# EAGLE schematic PPU_MINI (EAGLE 9.4.2)
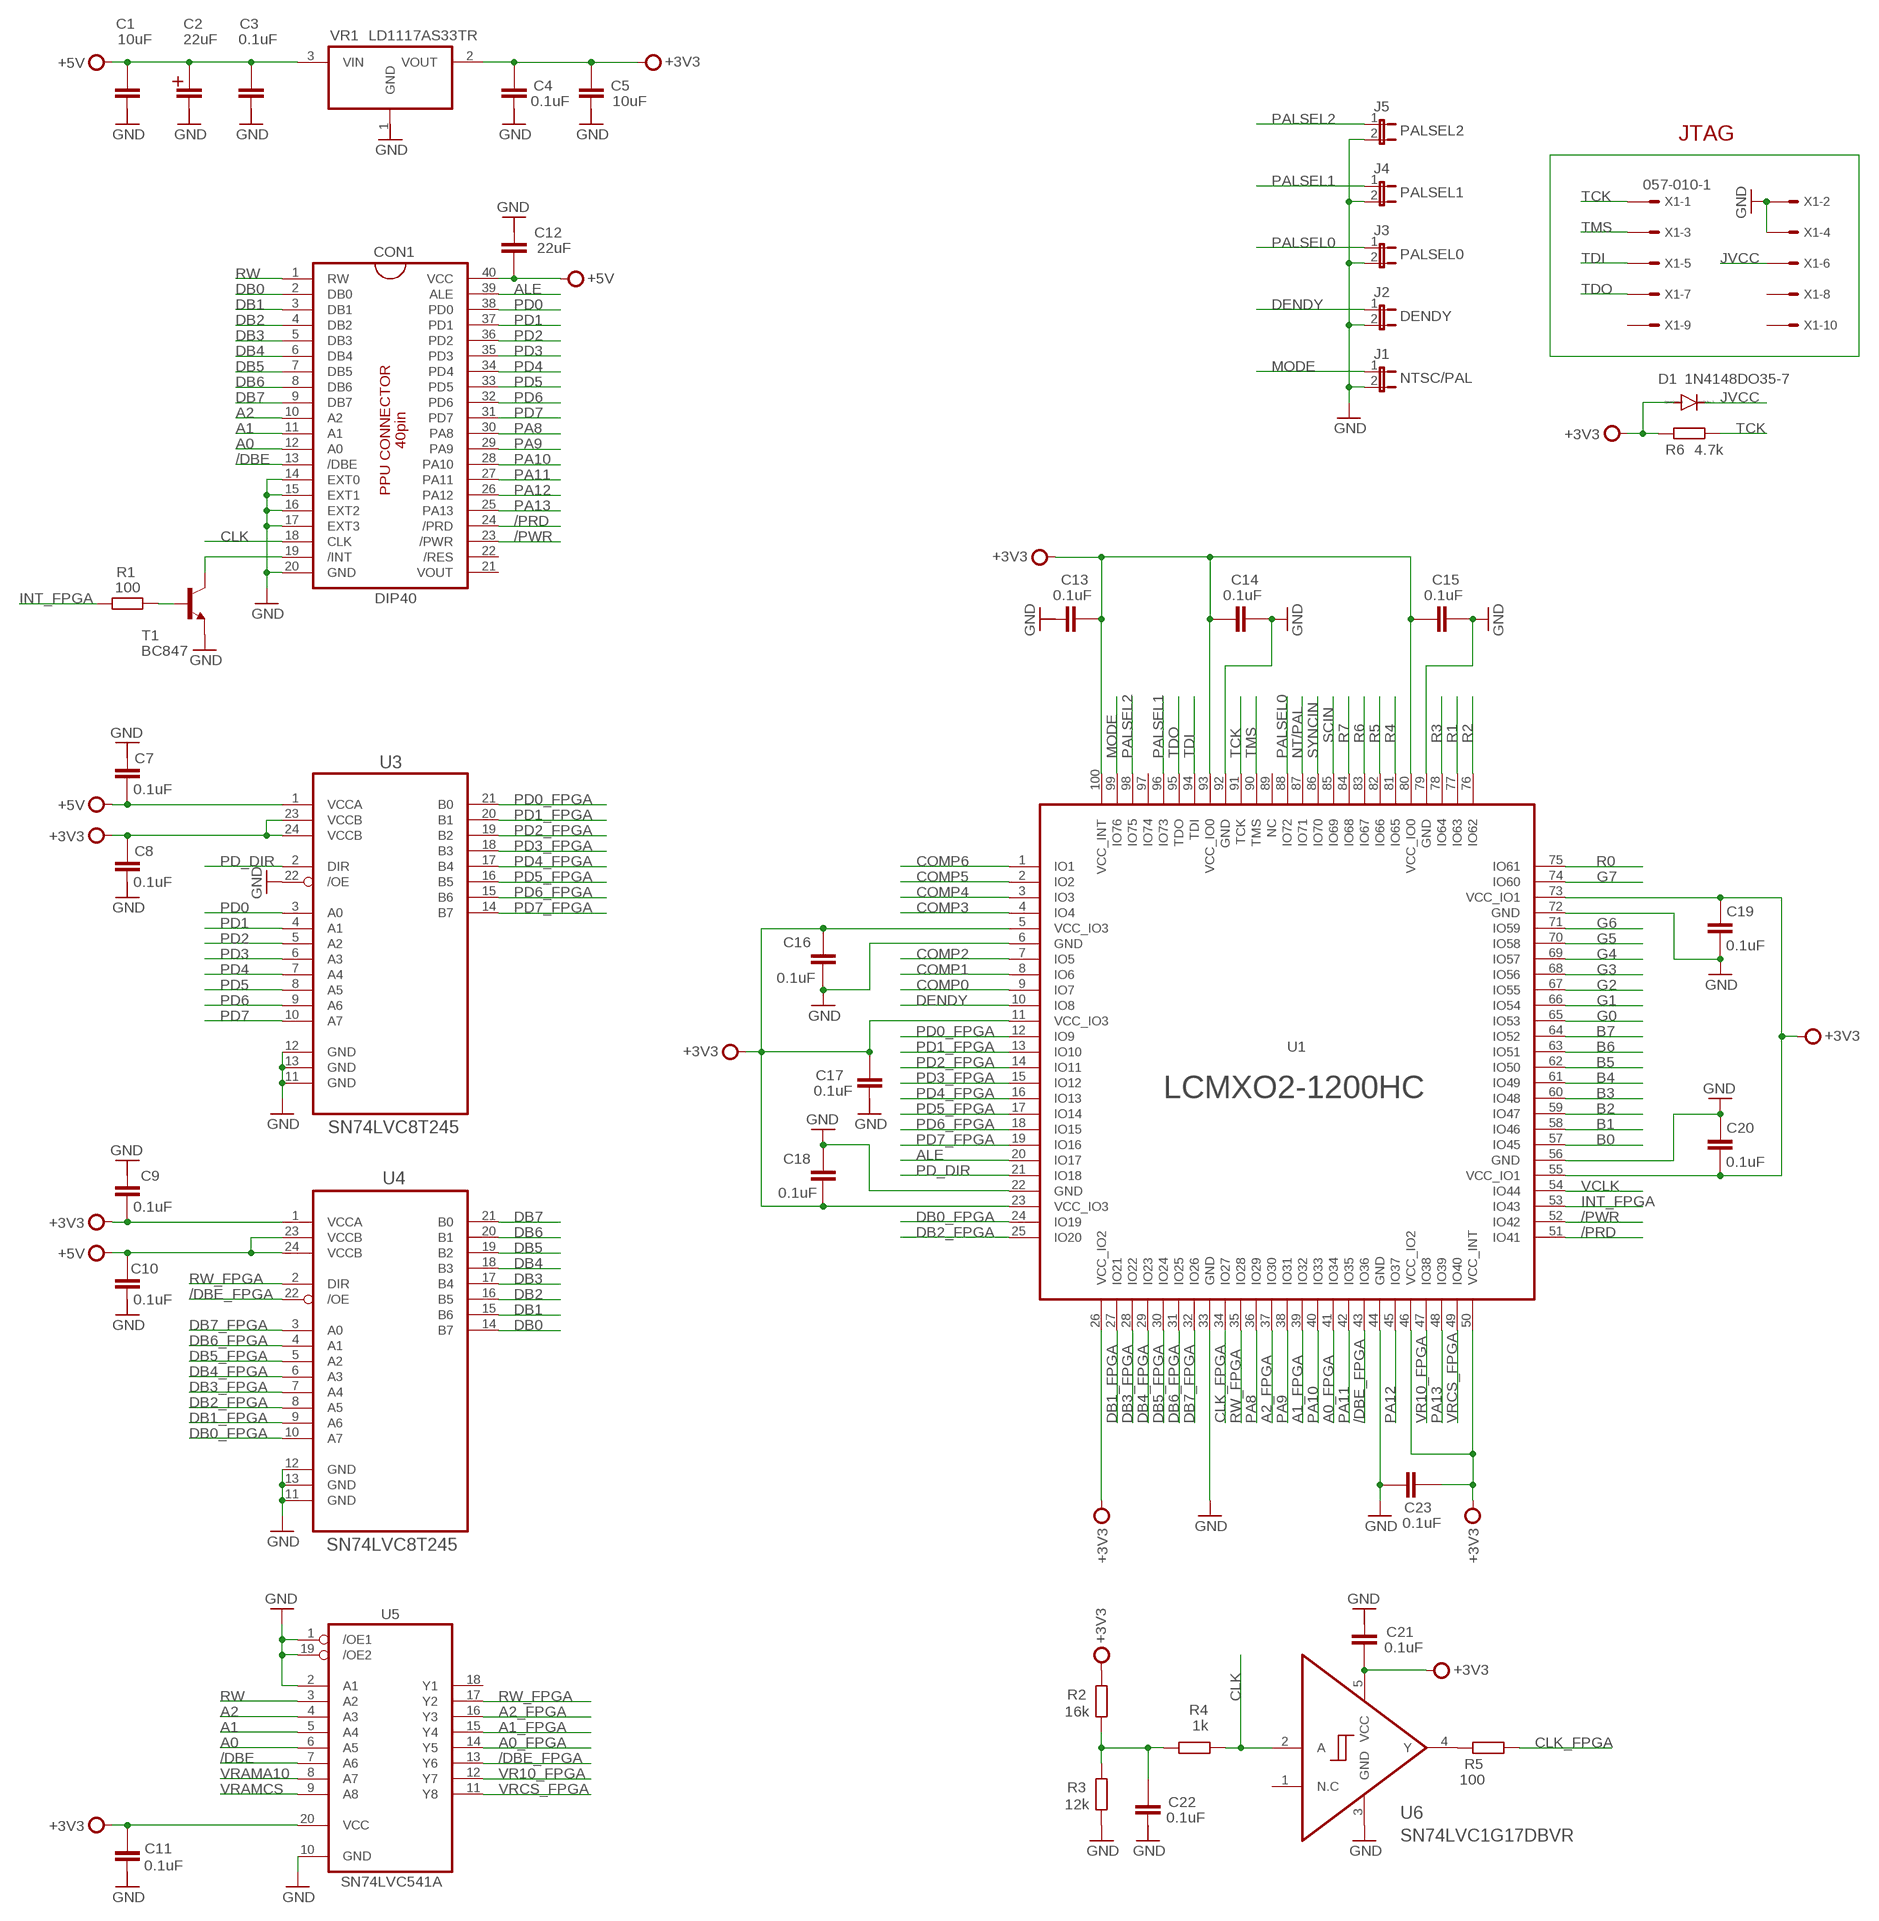
[diagram p0: schematic, sheet 1, part 1 of 2]
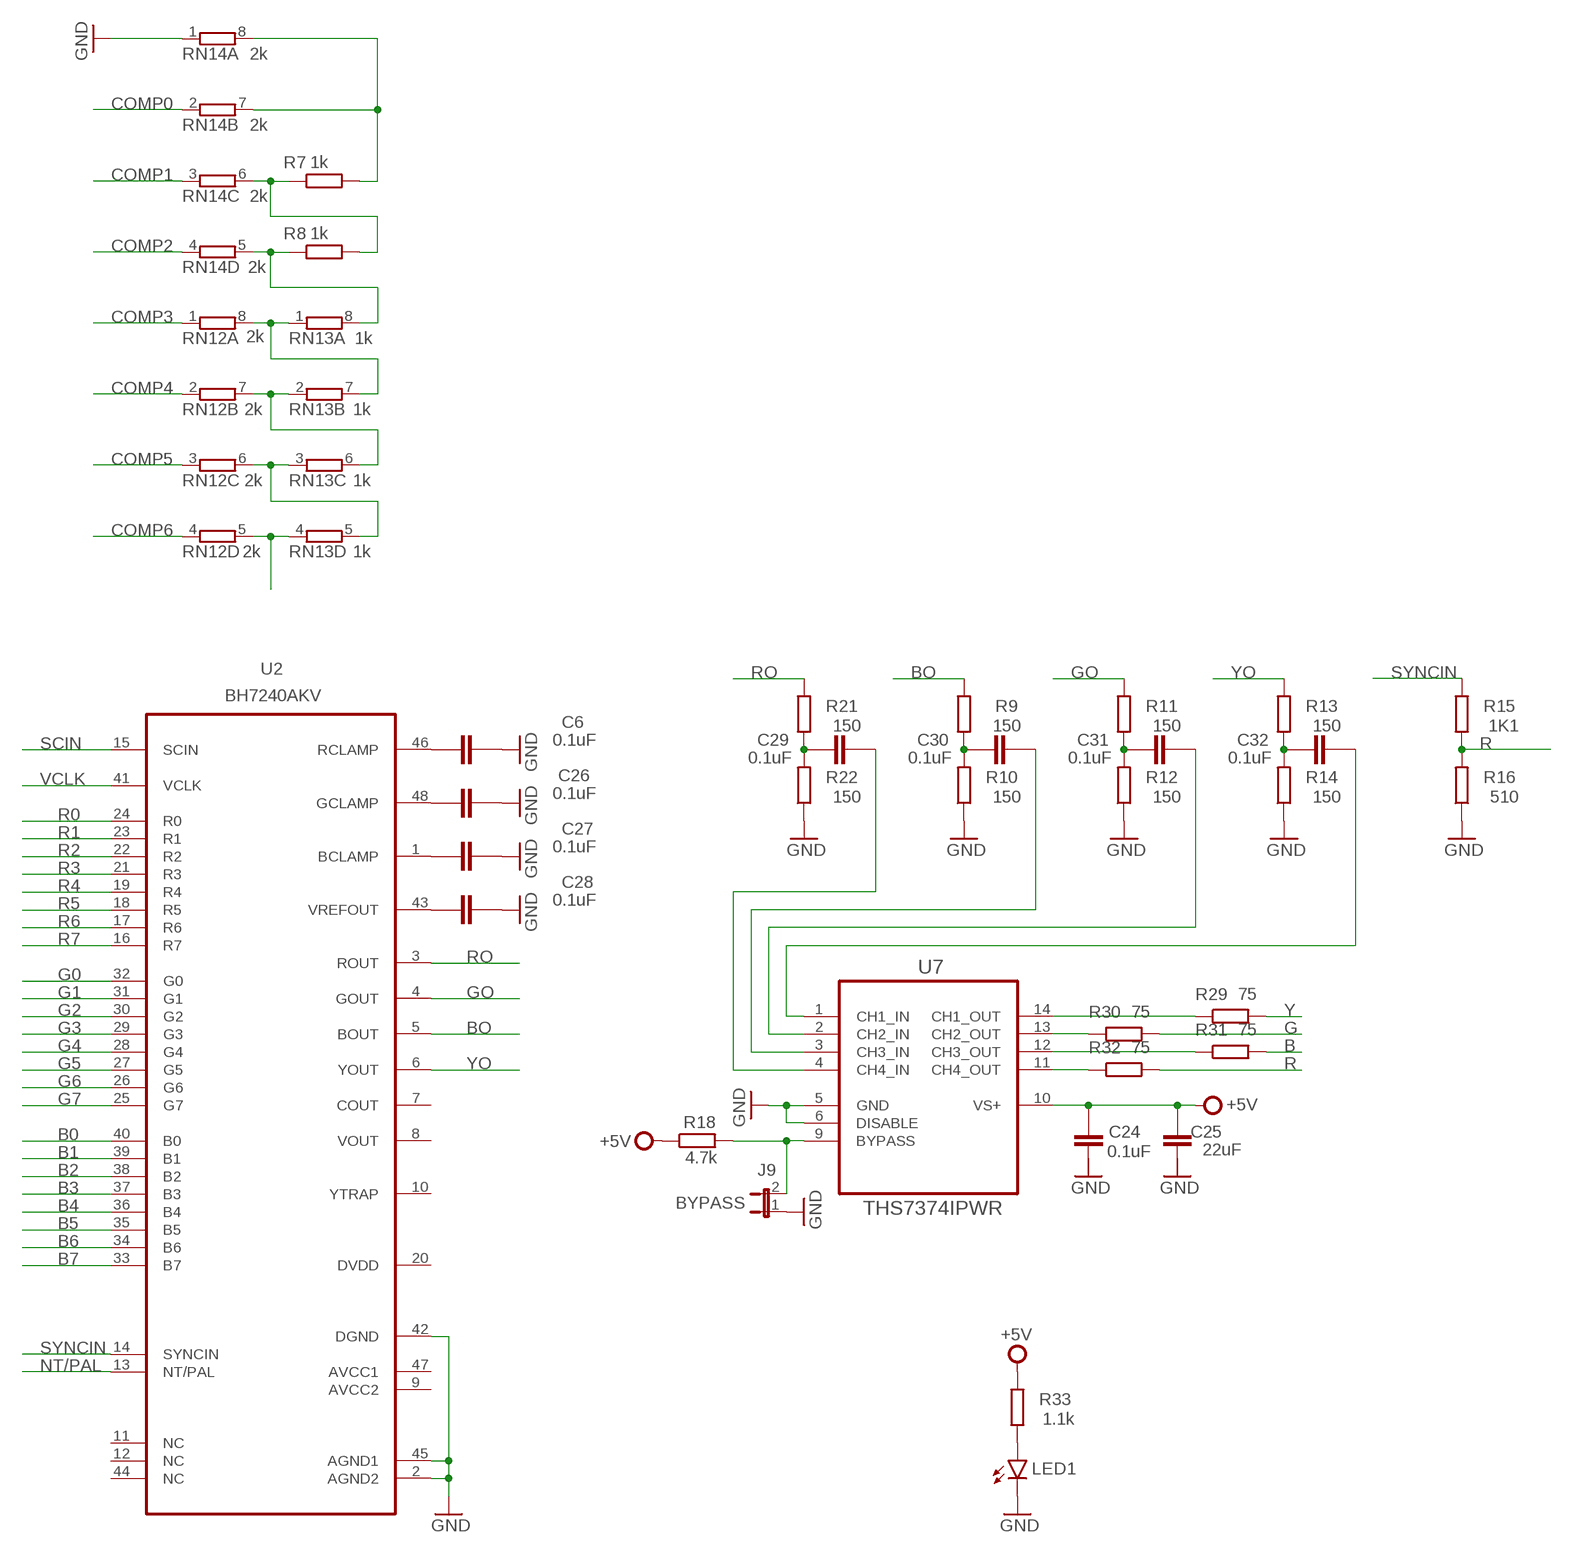
[diagram p1: schematic, sheet 1, part 2 of 2]

## Parts
C1  10uF  C-EUC0603  [C0603]
C2  22uF  CPOL-EU150CLZ-1014  [150CLZ-1014]
C3  0.1uF  C-EUC0603  [C0603]
C4  0.1uF  C-EUC0603  [C0603]
C5  10uF  C-EUC0603  [C0603]
C6  0.1uF  C-EUC0603  [C0603]
C7  0.1uF  C-EUC0603  [C0603]
C8  0.1uF  C-EUC0603  [C0603]
C9  0.1uF  C-EUC0603  [C0603]
C10  0.1uF  C-EUC0603  [C0603]
C11  0.1uF  C-EUC0603  [C0603]
C12  22uF  C-EUC0603  [C0603]
C13  0.1uF  C-EUC0603  [C0603]
C14  0.1uF  C-EUC0603  [C0603]
C15  0.1uF  C-EUC0603  [C0603]
C16  0.1uF  C-EUC0603  [C0603]
C17  0.1uF  C-EUC0603  [C0603]
C18  0.1uF  C-EUC0603  [C0603]
C19  0.1uF  C-EUC0603  [C0603]
C20  0.1uF  C-EUC0603  [C0603]
C21  0.1uF  C-EUC0603  [C0603]
C22  0.1uF  C-EUC0603  [C0603]
C23  0.1uF  C-EUC0603  [C0603]
C24  0.1uF  C-EUC0603  [C0603]
C25  22uF  C-EUC0603  [C0603]
C26  0.1uF  C-EUC0603  [C0603]
C27  0.1uF  C-EUC0603  [C0603]
C28  0.1uF  C-EUC0603  [C0603]
C29  0.1uF  C-EUC0603  [C0603]
C30  0.1uF  C-EUC0603  [C0603]
C31  0.1uF  C-EUC0603  [C0603]
C32  0.1uF  C-EUC0603  [C0603]
CON1  DIP40  [DIP-40]
D1  1N4148DO35-7  [DO35-7]
J1  NTSC/PAL  JP1E  [JP1]
J2  DENDY  JP1E  [JP1]
J3  PALSEL0  JP1E  [JP1]
J4  PALSEL1  JP1E  [JP1]
J5  PALSEL2  JP1E  [JP1]
J9  BYPASS  JP1E  [JP1]
LED1  LEDSML1206  [SML1206]
R1  100  R-EU_R0805  [R0805]
R2  16k  R-EU_R0805  [R0805]
R3  12k  R-EU_R0805  [R0805]
R4  1k  R-EU_R0805  [R0805]
R5  100  R-EU_R0805  [R0805]
R6  4.7k  R-EU_R0805  [R0805]
R7  1k  R-EU_R0805  [R0805]
R8  1k  R-EU_R0805  [R0805]
R9  150  R-EU_R0805  [R0805]
R10  150  R-EU_R0805  [R0805]
R11  150  R-EU_R0805  [R0805]
R12  150  R-EU_R0805  [R0805]
R13  150  R-EU_R0805  [R0805]
R14  150  R-EU_R0805  [R0805]
R15  1K1  R-EU_R0805  [R0805]
R16  510  R-EU_R0805  [R0805]
R18  4.7k  R-EU_R0805  [R0805]
R21  150  R-EU_R0805  [R0805]
R22  150  R-EU_R0805  [R0805]
R29  75  R-EU_R0805  [R0805]
R30  75  R-EU_R0805  [R0805]
R31  75  R-EU_R0805  [R0805]
R32  75  R-EU_R0805  [R0805]
R33  1.1k  R-EU_R0805  [R0805]
RN12  2k  4R-N0603-ARC  [0603-ARC]
RN13  1k  4R-N0603-ARC  [0603-ARC]
RN14  2k  4R-N0603-ARC  [0603-ARC]
T1  BC847  [SOT23]
U1  LCMXO2-1200HC  [QFP50P1600X1600X120-100N]
U2  BH7240AKV  [QFP50P900X900X160-48N]
U3  SN74LVC8T245  [SOP65P640X110-24N]
U4  SN74LVC8T245  [SOP65P640X110-24N]
U5  SN74LVC541A  [TSOP20]
U6  SN74LVC1G17DBVR  [SOT95P280X145-5N]
U7  THS7374IPWR  [SOP65P640X120-14N]
VR1  LD1117AS33TR  [SOT230P700X180-4N]
X1  057-010-1  [057-010-1]

## Nets
+3V3: C4.2 C5.2 C8.2 C9.1 C11.2 C13.1 C14.2 C15.2 C16.2 C17.2 C18.1 C19.2 C20.1 C21.1 D1.A R2.2 R6.2 U1.5(VCC_IO3) U1.11(VCC_IO3) U1.23(VCC_IO3) U1.26(VCC_IO2) U1.55(VCC_IO1) U1.73(VCC_IO1) U1.80(VCC_IO0) U1.93(VCC_IO0) U1.100(VCC_INT) U3.23(VCCB) U3.24(VCCB) U4.1(VCCA) U5.20(VCC) U6.5(VCC) VR1.2(VOUT)
+5V: C1.2 C2.+ C3.2 C7.1 C10.2 C12.1 C24.2 C25.2 CON1.40(VCC) R18.1 R33.2 U3.1(VCCA) U4.23(VCCB) U4.24(VCCB) U7.10(VS+) VR1.3(VIN)
/DBE: CON1.13(/DBE) U5.7(A6)
/DBE_FPGA: U1.43(IO36) U4.22(/OE) U5.13(Y6)
/PRD: CON1.24(/PRD) U1.51(IO41)
/PWR: CON1.23(/PWR) U1.52(IO42)
A0: CON1.12(A0) U5.6(A5)
A0_FPGA: U1.41(IO34) U5.14(Y5)
A1: CON1.11(A1) U5.5(A4)
A1_FPGA: U1.39(IO32) U5.15(Y4)
A2: CON1.10(A2) U5.4(A3)
A2_FPGA: U1.37(IO30) U5.16(Y3)
ALE: CON1.39(ALE) U1.20(IO17)
B: R31.2
B0: U1.57(IO45) U2.40(B0)
B1: U1.58(IO46) U2.39(B1)
B2: U1.59(IO47) U2.38(B2)
B3: U1.60(IO48) U2.37(B3)
B4: U1.61(IO49) U2.36(B4)
B5: U1.62(IO50) U2.35(B5)
B6: U1.63(IO51) U2.34(B6)
B7: U1.64(IO52) U2.33(B7)
BO: R9.2 U2.5(BOUT)
CLK: CON1.18(CLK) R4.1 U6.2(A)
CLK_FPGA: R5.1 U1.34(IO27)
COMP0: RN14.2 U1.9(IO7)
COMP1: RN14.3 U1.8(IO6)
COMP2: RN14.4 U1.7(IO5)
COMP3: RN12.1 U1.4(IO4)
COMP4: RN12.2 U1.3(IO3)
COMP5: RN12.3 U1.2(IO2)
COMP6: RN12.4 U1.1(IO1)
DB0: CON1.2(DB0) U4.14(B7)
DB0_FPGA: U1.24(IO19) U4.10(A7)
DB1: CON1.3(DB1) U4.15(B6)
DB1_FPGA: U1.27(IO21) U4.9(A6)
DB2: CON1.4(DB2) U4.16(B5)
DB2_FPGA: U1.25(IO20) U4.8(A5)
DB3: CON1.5(DB3) U4.17(B4)
DB3_FPGA: U1.28(IO22) U4.7(A4)
DB4: CON1.6(DB4) U4.18(B3)
DB4_FPGA: U1.29(IO23) U4.6(A3)
DB5: CON1.7(DB5) U4.19(B2)
DB5_FPGA: U1.30(IO24) U4.5(A2)
DB6: CON1.8(DB6) U4.20(B1)
DB6_FPGA: U1.31(IO25) U4.4(A1)
DB7: CON1.9(DB7) U4.21(B0)
DB7_FPGA: U1.32(IO26) U4.3(A0)
DENDY: J2.1 U1.10(IO8)
G: R30.2
G0: U1.65(IO53) U2.32(G0)
G1: U1.66(IO54) U2.31(G1)
G2: U1.67(IO55) U2.30(G2)
G3: U1.68(IO56) U2.29(G3)
G4: U1.69(IO57) U2.28(G4)
G5: U1.70(IO58) U2.27(G5)
G6: U1.71(IO59) U2.26(G6)
G7: U1.74(IO60) U2.25(G7)
GND: C6.1 C14.1 C15.1 C16.1 C18.2 C19.1 C20.2 C23.2 C26.1 C27.1 C28.1 CON1.14(EXT0) CON1.15(EXT1) CON1.16(EXT2) CON1.17(EXT3) CON1.20(GND) J1.2 J2.2 J3.2 J4.2 J5.2 J9.1 LED1.C R3.1 R10.1 R12.1 R14.1 R16.1 R22.1 RN14.1 T1.2(E) U1.6(GND) U1.22(GND) U1.33(GND) U1.44(GND) U1.56(GND) U1.72(GND) U1.79(GND) U1.92(GND) U2.2(AGND2) U2.42(DGND) U2.45(AGND1) U3.11(GND) U3.12(GND) U3.13(GND) U3.22(/OE) U4.11(GND) U4.12(GND) U4.13(GND) U5.1(/OE1) U5.2(A1) U5.10(GND) U5.19(/OE2) U6.3(GND) U7.5(GND) U7.6(DISABLE) X1.2 X1.4
GO: R11.2 U2.4(GOUT)
INT_FPGA: R1.1 U1.53(IO43)
JVCC: D1.C X1.6
MODE: J1.1 U1.99(IO76)
N$1: LED1.A R33.1
N$2: R5.2 U6.4(Y)
N$4: CON1.19(/INT) T1.3(C)
N$5: R1.2 T1.1(B)
N$6: RN12.8 RN13.1 RN13.7
N$7: R8.1 RN13.8 RN14.5
N$8: RN12.7 RN13.2 RN13.6
N$9: RN12.6 RN13.3 RN13.5
N$10: C6.2 U2.46(RCLAMP)
N$11: C26.2 U2.48(GCLAMP)
N$12: C27.2 U2.1(BCLAMP)
N$13: C28.2 U2.43(VREFOUT)
N$14: C30.2 R9.1 R10.2
N$15: J9.2 R18.2 U7.9(BYPASS)
N$16: C31.2 R11.1 R12.2
N$17: C29.1 U7.4(CH4_IN)
N$18: C30.1 U7.3(CH3_IN)
N$19: C31.1 U7.2(CH2_IN)
N$20: C32.2 R13.1 R14.2
N$21: C32.1 U7.1(CH1_IN)
N$24: R15.1 R16.2
N$26: R7.2 RN14.7 RN14.8
N$28: R7.1 R8.2 RN14.6
N$34: RN12.5 RN13.4
N$39: C23.1 U1.46(VCC_IO2) U1.50(VCC_INT) ; supply symbol labelled +3V3
N$40: C22.2 R2.1 R3.2 R4.2
N$42: C29.2 R21.1 R22.2
N$64: R29.1 U7.14(CH1_OUT)
N$65: R30.1 U7.13(CH2_OUT)
N$66: R31.1 U7.12(CH3_OUT)
N$67: R32.1 U7.11(CH4_OUT)
NT/PAL: U1.87(IO71) U2.13(NT/PAL)
PA8: CON1.30(PA8) U1.36(IO29)
PA9: CON1.29(PA9) U1.38(IO31)
PA10: CON1.28(PA10) U1.40(IO33)
PA11: CON1.27(PA11) U1.42(IO35)
PA12: CON1.26(PA12) U1.45(IO37)
PA13: CON1.25(PA13) U1.48(IO39)
PALSEL0: J3.1 U1.88(IO72)
PALSEL1: J4.1 U1.96(IO73)
PALSEL2: J5.1 U1.98(IO75)
PD0: CON1.38(PD0) U3.3(A0)
PD0_FPGA: U1.12(IO9) U3.21(B0)
PD1: CON1.37(PD1) U3.4(A1)
PD1_FPGA: U1.13(IO10) U3.20(B1)
PD2: CON1.36(PD2) U3.5(A2)
PD2_FPGA: U1.14(IO11) U3.19(B2)
PD3: CON1.35(PD3) U3.6(A3)
PD3_FPGA: U1.15(IO12) U3.18(B3)
PD4: CON1.34(PD4) U3.7(A4)
PD4_FPGA: U1.16(IO13) U3.17(B4)
PD5: CON1.33(PD5) U3.8(A5)
PD5_FPGA: U1.17(IO14) U3.16(B5)
PD6: CON1.32(PD6) U3.9(A6)
PD6_FPGA: U1.18(IO15) U3.15(B6)
PD7: CON1.31(PD7) U3.10(A7)
PD7_FPGA: U1.19(IO16) U3.14(B7)
PD_DIR: U1.21(IO18) U3.2(DIR)
R: R32.2
R0: U1.75(IO61) U2.24(R0)
R1: U1.77(IO63) U2.23(R1)
R2: U1.76(IO62) U2.22(R2)
R3: U1.78(IO64) U2.21(R3)
R4: U1.81(IO65) U2.19(R4)
R5: U1.82(IO66) U2.18(R5)
R6: U1.83(IO67) U2.17(R6)
R7: U1.84(IO68) U2.16(R7)
RO: R21.2 U2.3(ROUT)
RW: CON1.1(RW) U5.3(A2)
RW_FPGA: U1.35(IO28) U4.2(DIR) U5.17(Y2)
SCIN: U1.85(IO69) U2.15(SCIN)
SYNCIN: R15.2 U1.86(IO70) U2.14(SYNCIN)
TCK: R6.1 U1.91(TCK) X1.1
TDI: U1.94(TDI) X1.5
TDO: U1.95(TDO) X1.7
TMS: U1.90(TMS) X1.3
VCLK: U1.54(IO44) U2.41(VCLK)
VR10_FPGA: U1.47(IO38) U5.12(Y7)
VRAMA10: U5.8(A7)
VRAMCS: U5.9(A8)
VRCS_FPGA: U1.49(IO40) U5.11(Y8)
Y: R29.2
YO: R13.2 U2.6(YOUT)
Unconnected: C1.1 C2.- C3.1 C4.1 C5.1 C7.2 C8.1 C9.2 C10.1 C11.1 C12.2 C13.2 C17.1 C21.2 C22.1 C24.1 C25.1 CON1.21(VOUT) CON1.22(/RES) U1.89(NC) U1.97(IO74) U2.7(COUT) U2.8(VOUT) U2.9(AVCC2) U2.10(YTRAP) U2.11(NC) U2.12(NC) U2.20(DVDD) U2.44(NC) U2.47(AVCC1) U5.18(Y1) U6.1(N.C) VR1.1(GND) X1.8 X1.9 X1.10

## Notes on the sheet
- JTAG

## Library data of the parts
C1 C3-C32 = rcl_my:C-EU: CAPACITOR, European symbol; SPICEPREFIX: C
C2 = rcl_my:CPOL-EU: POLARIZED CAPACITOR, European symbol; SPICEPREFIX: C
CON1 = SnapEDA-Library:DIP40
D1 = diode:1N4148: DIODE high speed (Philips)
J1-J5 J9 = jumper:JP1E: JUMPER
LED1 = led:LED: LED OSRAM: - CHIPLED LG R971, LG N971, LY N971, LG Q971, LY Q971, LO R971, LY R971 LH N974, LH R974 LS Q976, LO Q976, LY Q976 LO Q996 - Hyper CHIPLED LW Q18S LB Q993, LB Q99A, LB R99A - SideLED LS A670, LO A670, LY A670, LG A670, LP A670 LB A673, LV A673, LT A673, LW A673 LH A674 LY A675 LS A676, LA A676, LO A676, LY A676, LW A676 LS A679, LY A679, LG A679 - Hyper Micro SIDELED® LS Y876, LA Y876, LO Y876, LY Y876 LT Y87S - SmartLED LW L88C, LW L88S LB L89C, LB L89S, LG L890 LS L89K, LO L89K, LY L89K LS L896, LA L896, LO L896, LY L896 - TOPLED LS T670, LO T670, LY T670, LG T670, LP T670 LSG T670, LSP T670, LSY T670, LOP T670, LYG T670 LG T671, LOG T671, LSG T671 LB T673, LV T673, LT T673, LW T673 LH T674 LS T676, LA T676, LO T676, LY T676, LB T676, LH T676, LSB T676, LW T676 LB T67C, LV T67C, LT T67C, LS T67K, LO T67K, LY T67K, LW E67C LS E67B, LA E67B, LO E67B, LY E67B, LB E67C, LV E67C, LT E67C LW T67C LS T679, LY T679, LG T679 LS T770, LO T770, LY T770, LG T770, LP T770 LB T773, LV T773, LT T773, LW T773 LH T774 LS E675, LA E675, LY E675, LS T675 LS T776, LA T776, LO T776, LY T776, LB T776 LHGB T686 LT T68C, LB T68C - Hyper Mini TOPLED® LB M676 - Mini TOPLED Santana® LG M470 LS M47K, LO M47K, LY M47K Source: http://www.osram.convergy.de LUXEON: - LUMILED® LXK2-PW12-R00, LXK2-PW12-S00, LXK2-PW14-U00, LXK2-PW14-V00 LXK2-PM12-R00, LXK2-PM12-S00, LXK2-PM14-U00 LXK2-PE12-Q00, LXK2-PE12-R00, LXK2-PE12-S00, LXK2-PE14-T00, LXK2-PE14-U00 LXK2-PB12-K00, LXK2-PB12-L00, LXK2-PB12-M00, LXK2-PB14-N00, LXK2-PB14-P00, LXK2-PB14-Q00 LXK2-PR12-L00, LXK2-PR12-M00, LXK2-PR14-Q00, LXK2-PR14-R00 LXK2-PD12-Q00, LXK2-PD12-R00, LXK2-PD12-S00 LXK2-PH12-R00, LXK2-PH12-S00 LXK2-PL12-P00, LXK2-PL12-Q00, LXK2-PL12-R00 Source: www.luxeon.com KINGBRIGHT: KA-3528ASYC Source: www.kingbright.com
R1-R16 R18 R21 R22 R29-R33 = rcl:R-EU_: RESISTOR, European symbol; SPICEPREFIX: R
RN12-RN14 = resistor-dil:4R-N: Array Chip Resistor Source: RS Component / Phycomp; OC_FARNELL: unknown; OC_NEWARK: unknown
T1 = transistor:BC847: NPN TRANSISTOR
U1 = LCMXO2-1200HC:LCMXO2-1200HC
U2 = BH7240AKV:BH7240AKV
U3 U4 = SnapEDA-Library:SN74LVC8T245
U5 = SnapEDA-Library:SN74LVC541A; PACKAGE: TSSOP-20; SUPPLIER: TI
U6 = SN74LVC1G17DBVR:SN74LVC1G17DBVR
U7 = THS7374IPWR:THS7374IPWR
VR1 = LD1117AS33TR:LD1117AS33TR
X1 = con-panduit:057-010-: CONNECTOR 10-pin series 057 contact pc board low profile headers; OC_FARNELL: unknown; OC_NEWARK: unknown